# EAGLE design buttons_board (EAGLE 9.1.0)
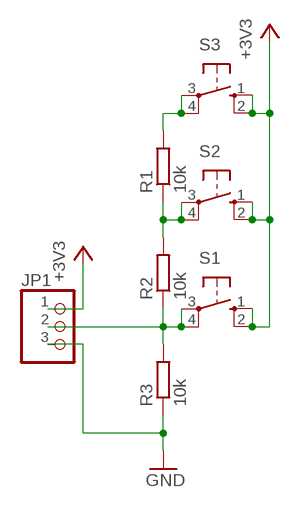
[diagram p0: schematic, sheet 1]

## Parts
JP1  PINHD-1X3/90  [1X03/90]
R1  10k  R-EU_R1206  [R1206]
R2  10k  R-EU_R1206  [R1206]
R3  10k  R-EU_R1206  [R1206]
S1  10-XX  [B3F-10XX]
S2  10-XX  [B3F-10XX]
S3  10-XX  [B3F-10XX]

## Nets
+3V3: JP1.1 S1.1(S) S1.2(S1) S2.1(S) S2.2(S1) S3.1(S) S3.2(S1)
GND: JP1.3 R3.1
N$1: JP1.2 R2.1 R3.2 S1.3(P) S1.4(P1)
N$2: R1.1 R2.2 S2.3(P) S2.4(P1)
N$3: R1.2 S3.3(P) S3.4(P1)

## Library data of the parts
JP1 = pinhead:PINHD-1X3: PIN HEADER
R1-R3 = rcl:R-EU_: RESISTOR, European symbol; SPICEPREFIX: R
S1-S3 = switch-omron:10-XX: OMRON SWITCH; MPN: B3F-1000; OC_FARNELL: 176432; OC_NEWARK: 36M3542

## Board
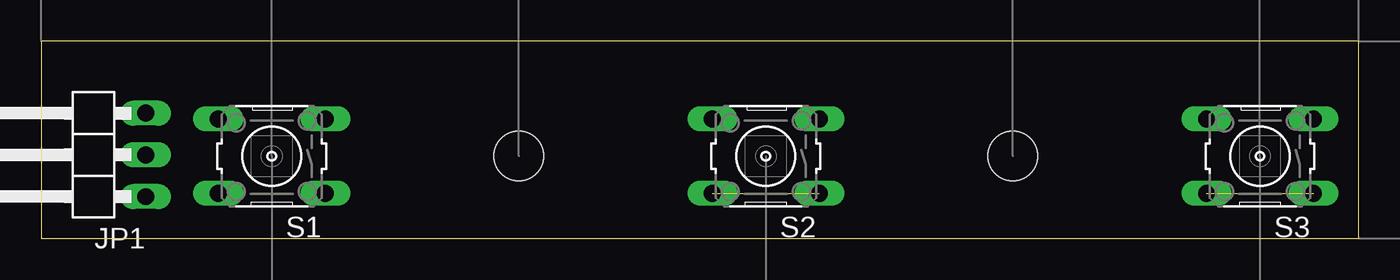
[diagram p1: board, top side]
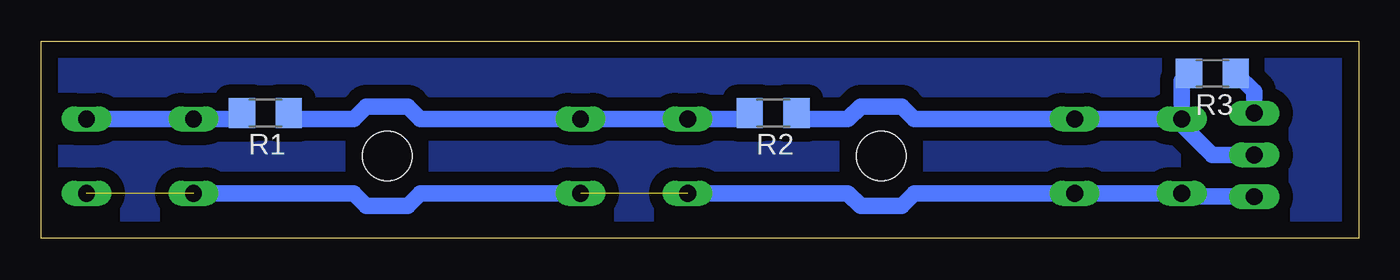
[diagram p2: board, bottom side, seen from below]

Size 80 x 12 mm. Coordinates in mm from the lower left corner, seen from the top.
Outline: 0,0 80,0 80,12 0,12 0,0
Copper layers (1*16): Top 0.035mm / dielectric 1.5mm / Bottom 0.035mm
Design rules "default *": minimum track width 6mil, minimum drill 0.35mm, track to track 32mil, track to pad 32mil, pad to pad 32mil, via to via 6mil, smd to smd 6mil, copper to edge 40mil, drill to drill 6mil, minimum pad ring 10mil, minimum via ring 8mil, stop-mask expansion 4mil, vias tented up to drill 0mil, thermal gap 10mil
Holes 3 mm at 29,5 59,5

### Footprints (pad centres in the part's own frame; a part is rotated, then mirrored left to right if it is on the bottom)
1X03/90 = drill 1.016 long: 1 -2.54,-3.81; 2 0,-3.81; 3 2.54,-3.81
R1206 = smd 1.6 x 1.803: 1 -1.422,0; 2 1.422,0
B3F-10XX = drill 1.016 long: 1 -3.251,2.261; 2 3.251,2.261; 3 -3.251,-2.261; 4 3.251,-2.261

### Placement (x,y rotation side)
JP1  2.54,5.08 90 top
R1  66.39,7.62 180 bottom
R2  35.56,7.62 180 bottom
R3  8.89,10.03 180 bottom
S1  14,5 180 top
S2  44,5 180 top
S3  74,5 180 top

### Tracks (layer width: path | path; a pad name or v marks a point on that pad's centre or on a via)
+3V3  (2 unrouted)
  Bottom 1.016: JP1.1 10.55,2.54 S1.2 S1.1 26.98,2.74 27.75,1.98 30.25,1.98 31.02,2.74 S2.2 | S3.2 61.02,2.74 60.25,1.98 57.75,1.98 56.98,2.74 S2.1
GND
  Bottom 1.016: JP1.3 6.35,8.91 R3.1
N$1
  Bottom 1.016: JP1.2 8.89,5.08 10.75,6.94 | 10.75,6.94 S1.4 10.75,9.6 R3.2 | 10.75,6.94 11.07,7.26 S1.3 26.98,7.26 27.75,8.02 30.25,8.02 31.02,7.26 33.78,7.26 R2.1
N$2
  Bottom 1.016: R1.1 64.61,7.26 61.02,7.26 60.25,8.02 57.75,8.02 56.98,7.26 S2.3 S2.4 37.34,7.26 R2.2
N$3
  Bottom 1.016: S3.3 S3.4 68.17,7.26 R1.2
POLYGON
  pour Bottom: 0,0 80.01,0 80.01,12.7 0,12.7